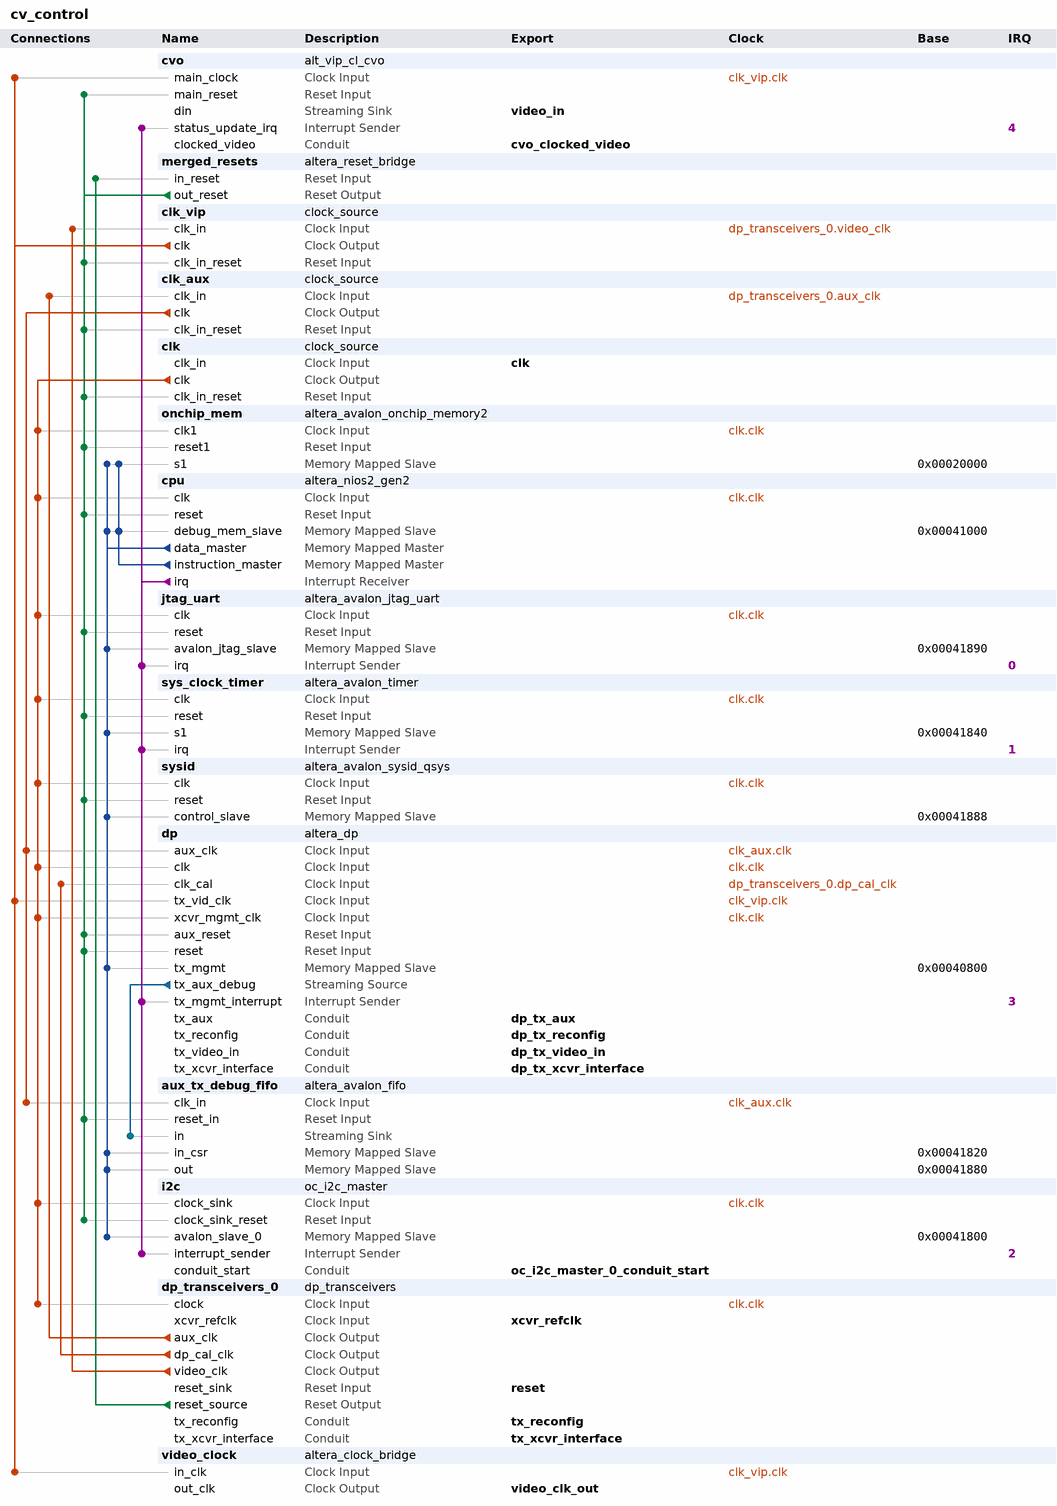
[diagram p0: system contents]
# Platform Designer (Qsys) system cv_control, Cyclone V 5CSXFC6C6U23C7
# Parameters at their usual value, and those the tool derives, are not listed.
package require -exact qsys 16.0
create_system cv_control
set_project_property DEVICE_FAMILY {Cyclone V}
set_project_property DEVICE 5CSXFC6C6U23C7

add_instance cvo alt_vip_cl_cvo 16.0
set_instance_parameter_value cvo ACCEPT_COLOURS_IN_SEQ 0
set_instance_parameter_value cvo ANC_LINE 0
set_instance_parameter_value cvo AP_LINE 0
set_instance_parameter_value cvo BPS 8
set_instance_parameter_value cvo CLOCKS_ARE_SAME 0
set_instance_parameter_value cvo COLOUR_PLANES_ARE_IN_PARALLEL 1
set_instance_parameter_value cvo CONTEXT_WIDTH 8
set_instance_parameter_value cvo DST_WIDTH 8
set_instance_parameter_value cvo FIELD0_ANC_LINE 0
set_instance_parameter_value cvo FIELD0_V_BACK_PORCH 0
set_instance_parameter_value cvo FIELD0_V_BLANK 0
set_instance_parameter_value cvo FIELD0_V_FRONT_PORCH 0
set_instance_parameter_value cvo FIELD0_V_RISING_EDGE 0
set_instance_parameter_value cvo FIELD0_V_SYNC_LENGTH 0
set_instance_parameter_value cvo FIFO_DEPTH 1920
set_instance_parameter_value cvo F_FALLING_EDGE 0
set_instance_parameter_value cvo F_RISING_EDGE 0
set_instance_parameter_value cvo GENERATE_SYNC 0
set_instance_parameter_value cvo H_ACTIVE_PIXELS 1920
set_instance_parameter_value cvo H_BACK_PORCH 80
set_instance_parameter_value cvo H_BLANK 0
set_instance_parameter_value cvo H_FRONT_PORCH 48
set_instance_parameter_value cvo H_SYNC_LENGTH 32
set_instance_parameter_value cvo INTERLACED 0
set_instance_parameter_value cvo NO_OF_CHANNELS 1
set_instance_parameter_value cvo NO_OF_MODES 1
set_instance_parameter_value cvo NUMBER_OF_COLOUR_PLANES 3
set_instance_parameter_value cvo PIXELS_IN_PARALLEL 1
set_instance_parameter_value cvo SRC_WIDTH 8
set_instance_parameter_value cvo STD_WIDTH 1
set_instance_parameter_value cvo TASK_WIDTH 8
set_instance_parameter_value cvo THRESHOLD 1919
set_instance_parameter_value cvo USE_CONTROL 0
set_instance_parameter_value cvo USE_EMBEDDED_SYNCS 0
set_instance_parameter_value cvo V_ACTIVE_LINES 1080
set_instance_parameter_value cvo V_BACK_PORCH 26
set_instance_parameter_value cvo V_BLANK 0
set_instance_parameter_value cvo V_FRONT_PORCH 3
set_instance_parameter_value cvo V_SYNC_LENGTH 6

add_instance merged_resets altera_reset_bridge 16.0
set_instance_parameter_value merged_resets ACTIVE_LOW_RESET 1
set_instance_parameter_value merged_resets SYNCHRONOUS_EDGES none

add_instance clk_vip clock_source 16.0
set_instance_parameter_value clk_vip clockFrequency 154000000

add_instance clk_aux clock_source 16.0
set_instance_parameter_value clk_aux clockFrequency 16000000

add_instance clk clock_source 16.0
set_instance_parameter_value clk clockFrequency 100000000

add_instance onchip_mem altera_avalon_onchip_memory2 16.0
set_instance_parameter_value onchip_mem dataWidth 32
set_instance_parameter_value onchip_mem dualPort false
set_instance_parameter_value onchip_mem initMemContent true
set_instance_parameter_value onchip_mem initializationFileName dp_demo.hex
set_instance_parameter_value onchip_mem memorySize 120000
set_instance_parameter_value onchip_mem useNonDefaultInitFile true

add_instance cpu altera_nios2_gen2 16.0
set_instance_parameter_value cpu dcache_size 2048
set_instance_parameter_value cpu exceptionSlave onchip_mem.s1
set_instance_parameter_value cpu icache_size 2048
set_instance_parameter_value cpu impl Tiny
set_instance_parameter_value cpu resetSlave onchip_mem.s1
set_instance_parameter_value cpu setting_activateTrace true

add_instance jtag_uart altera_avalon_jtag_uart 16.0
set_instance_parameter_value jtag_uart readBufferDepth 1024
set_instance_parameter_value jtag_uart readIRQThreshold 1
set_instance_parameter_value jtag_uart simInteractiveOptions INTERACTIVE_ASCII_OUTPUT
set_instance_parameter_value jtag_uart writeBufferDepth 1024
set_instance_parameter_value jtag_uart writeIRQThreshold 1

add_instance sys_clock_timer altera_avalon_timer 16.0
set_instance_parameter_value sys_clock_timer period 1
set_instance_parameter_value sys_clock_timer periodUnits MSEC

add_instance sysid altera_avalon_sysid_qsys 16.0
set_instance_parameter_value sysid id 0

add_instance dp altera_dp 16.0.1
set_instance_parameter_value dp RX_AUDIO_CHANS 2
set_instance_parameter_value dp RX_AUX_DEBUG 1
set_instance_parameter_value dp RX_AUX_GPU 0
set_instance_parameter_value dp RX_EXPORT_MSA 0
set_instance_parameter_value dp RX_I2C_SCL_KHZ 100
set_instance_parameter_value dp RX_IEEE_OUI 1
set_instance_parameter_value dp RX_MAX_LANE_COUNT 4
set_instance_parameter_value dp RX_MAX_LINK_RATE 10
set_instance_parameter_value dp RX_MAX_NUM_OF_STREAMS 1
set_instance_parameter_value dp RX_PIXELS_PER_CLOCK 1
set_instance_parameter_value dp RX_SCRAMBLER_SEED 65535
set_instance_parameter_value dp RX_SUPPORT_AUDIO 0
set_instance_parameter_value dp RX_SUPPORT_AUTOMATED_TEST 1
set_instance_parameter_value dp RX_SUPPORT_DP 0
set_instance_parameter_value dp RX_SUPPORT_GTC 0
set_instance_parameter_value dp RX_SUPPORT_I2CMASTER 0
set_instance_parameter_value dp RX_SUPPORT_MST 0
set_instance_parameter_value dp RX_SUPPORT_SS 0
set_instance_parameter_value dp RX_SYMBOLS_PER_CLOCK 2
set_instance_parameter_value dp RX_VIDEO_BPS 8
set_instance_parameter_value dp TX_AUDIO_CHANS 2
set_instance_parameter_value dp TX_AUX_DEBUG 1
set_instance_parameter_value dp TX_MAX_LANE_COUNT 4
set_instance_parameter_value dp TX_MAX_LINK_RATE 10
set_instance_parameter_value dp TX_MAX_NUM_OF_STREAMS 1
set_instance_parameter_value dp TX_PIXELS_PER_CLOCK 1
set_instance_parameter_value dp TX_SCRAMBLER_SEED 65535
set_instance_parameter_value dp TX_SUPPORT_ANALOG_RECONFIG 0
set_instance_parameter_value dp TX_SUPPORT_AUDIO 0
set_instance_parameter_value dp TX_SUPPORT_AUTOMATED_TEST 1
set_instance_parameter_value dp TX_SUPPORT_DP 1
set_instance_parameter_value dp TX_SUPPORT_GTC 0
set_instance_parameter_value dp TX_SUPPORT_MST 0
set_instance_parameter_value dp TX_SUPPORT_SS 0
set_instance_parameter_value dp TX_SYMBOLS_PER_CLOCK 2
set_instance_parameter_value dp TX_VIDEO_BPS 8
set_instance_parameter_value dp device_family {Cyclone V}

add_instance aux_tx_debug_fifo altera_avalon_fifo 16.0
set_instance_parameter_value aux_tx_debug_fifo bitsPerSymbol 32
set_instance_parameter_value aux_tx_debug_fifo channelWidth 1
set_instance_parameter_value aux_tx_debug_fifo errorWidth 1
set_instance_parameter_value aux_tx_debug_fifo fifoDepth 2048
set_instance_parameter_value aux_tx_debug_fifo fifoInputInterfaceOptions AVALONST_SINK
set_instance_parameter_value aux_tx_debug_fifo fifoOutputInterfaceOptions AVALONMM_READ
set_instance_parameter_value aux_tx_debug_fifo singleClockMode true
set_instance_parameter_value aux_tx_debug_fifo symbolsPerBeat 1
set_instance_parameter_value aux_tx_debug_fifo useBackpressure false
set_instance_parameter_value aux_tx_debug_fifo useIRQ false
set_instance_parameter_value aux_tx_debug_fifo usePacket true
set_instance_parameter_value aux_tx_debug_fifo useReadControl false

add_instance i2c oc_i2c_master 1.0

add_instance dp_transceivers_0 dp_transceivers 1.0
set_instance_parameter_value dp_transceivers_0 LANES 4
set_instance_parameter_value dp_transceivers_0 RX_SYMBOLS_PER_CLOCK 2
set_instance_parameter_value dp_transceivers_0 TX_POLINV 0
set_instance_parameter_value dp_transceivers_0 TX_SYMBOLS_PER_CLOCK 2

add_instance video_clock altera_clock_bridge 16.0
set_instance_parameter_value video_clock DERIVED_CLOCK_RATE 154000000
set_instance_parameter_value video_clock EXPLICIT_CLOCK_RATE 0

# connections
add_connection clk.clk cpu.clk clock
add_connection clk.clk dp.clk clock
add_connection clk.clk dp.xcvr_mgmt_clk clock
add_connection clk.clk dp_transceivers_0.clock clock
add_connection clk.clk i2c.clock_sink clock
add_connection clk.clk jtag_uart.clk clock
add_connection clk.clk onchip_mem.clk1 clock
add_connection clk.clk sys_clock_timer.clk clock
add_connection clk.clk sysid.clk clock
add_connection clk_aux.clk aux_tx_debug_fifo.clk_in clock
add_connection clk_aux.clk dp.aux_clk clock
add_connection clk_vip.clk cvo.main_clock clock
add_connection clk_vip.clk dp.tx_vid_clk clock
add_connection clk_vip.clk video_clock.in_clk clock
add_connection dp_transceivers_0.aux_clk clk_aux.clk_in clock
add_connection dp_transceivers_0.dp_cal_clk dp.clk_cal clock
add_connection dp_transceivers_0.video_clk clk_vip.clk_in clock
add_connection dp_transceivers_0.reset_source merged_resets.in_reset reset
add_connection merged_resets.out_reset aux_tx_debug_fifo.reset_in reset
add_connection merged_resets.out_reset clk.clk_in_reset reset
add_connection merged_resets.out_reset clk_aux.clk_in_reset reset
add_connection merged_resets.out_reset clk_vip.clk_in_reset reset
add_connection merged_resets.out_reset cpu.reset reset
add_connection merged_resets.out_reset cvo.main_reset reset
add_connection merged_resets.out_reset dp.aux_reset reset
add_connection merged_resets.out_reset dp.reset reset
add_connection merged_resets.out_reset i2c.clock_sink_reset reset
add_connection merged_resets.out_reset jtag_uart.reset reset
add_connection merged_resets.out_reset onchip_mem.reset1 reset
add_connection merged_resets.out_reset sys_clock_timer.reset reset
add_connection merged_resets.out_reset sysid.reset reset
add_connection cpu.data_master aux_tx_debug_fifo.in_csr avalon
set_connection_parameter_value cpu.data_master/aux_tx_debug_fifo.in_csr baseAddress 0x00041820
add_connection cpu.data_master aux_tx_debug_fifo.out avalon
set_connection_parameter_value cpu.data_master/aux_tx_debug_fifo.out baseAddress 0x00041880
add_connection cpu.data_master cpu.debug_mem_slave avalon
set_connection_parameter_value cpu.data_master/cpu.debug_mem_slave baseAddress 0x00041000
add_connection cpu.data_master dp.tx_mgmt avalon
set_connection_parameter_value cpu.data_master/dp.tx_mgmt baseAddress 0x00040800
add_connection cpu.data_master i2c.avalon_slave_0 avalon
set_connection_parameter_value cpu.data_master/i2c.avalon_slave_0 baseAddress 0x00041800
add_connection cpu.data_master jtag_uart.avalon_jtag_slave avalon
set_connection_parameter_value cpu.data_master/jtag_uart.avalon_jtag_slave baseAddress 0x00041890
add_connection cpu.data_master onchip_mem.s1 avalon
set_connection_parameter_value cpu.data_master/onchip_mem.s1 baseAddress 0x00020000
add_connection cpu.data_master sys_clock_timer.s1 avalon
set_connection_parameter_value cpu.data_master/sys_clock_timer.s1 baseAddress 0x00041840
add_connection cpu.data_master sysid.control_slave avalon
set_connection_parameter_value cpu.data_master/sysid.control_slave baseAddress 0x00041888
add_connection cpu.instruction_master cpu.debug_mem_slave avalon
set_connection_parameter_value cpu.instruction_master/cpu.debug_mem_slave baseAddress 0x00041000
add_connection cpu.instruction_master onchip_mem.s1 avalon
set_connection_parameter_value cpu.instruction_master/onchip_mem.s1 baseAddress 0x00020000
add_connection dp.tx_aux_debug aux_tx_debug_fifo.in avalon_streaming
add_connection cpu.irq cvo.status_update_irq interrupt
set_connection_parameter_value cpu.irq/cvo.status_update_irq irqNumber 4
add_connection cpu.irq dp.tx_mgmt_interrupt interrupt
set_connection_parameter_value cpu.irq/dp.tx_mgmt_interrupt irqNumber 3
add_connection cpu.irq i2c.interrupt_sender interrupt
set_connection_parameter_value cpu.irq/i2c.interrupt_sender irqNumber 2
add_connection cpu.irq jtag_uart.irq interrupt
set_connection_parameter_value cpu.irq/jtag_uart.irq irqNumber 0
add_connection cpu.irq sys_clock_timer.irq interrupt
set_connection_parameter_value cpu.irq/sys_clock_timer.irq irqNumber 1

# exported interfaces
add_interface clk clock sink
set_interface_property clk EXPORT_OF clk.clk_in
add_interface cvo_clocked_video conduit end
set_interface_property cvo_clocked_video EXPORT_OF cvo.clocked_video
add_interface dp_tx_aux conduit end
set_interface_property dp_tx_aux EXPORT_OF dp.tx_aux
add_interface dp_tx_reconfig conduit end
set_interface_property dp_tx_reconfig EXPORT_OF dp.tx_reconfig
add_interface dp_tx_video_in conduit end
set_interface_property dp_tx_video_in EXPORT_OF dp.tx_video_in
add_interface dp_tx_xcvr_interface conduit end
set_interface_property dp_tx_xcvr_interface EXPORT_OF dp.tx_xcvr_interface
add_interface oc_i2c_master_0_conduit_start conduit end
set_interface_property oc_i2c_master_0_conduit_start EXPORT_OF i2c.conduit_start
add_interface reset reset sink
set_interface_property reset EXPORT_OF dp_transceivers_0.reset_sink
add_interface tx_reconfig conduit end
set_interface_property tx_reconfig EXPORT_OF dp_transceivers_0.tx_reconfig
add_interface tx_xcvr_interface conduit end
set_interface_property tx_xcvr_interface EXPORT_OF dp_transceivers_0.tx_xcvr_interface
add_interface video_clk_out clock source
set_interface_property video_clk_out EXPORT_OF video_clock.out_clk
add_interface video_in avalon_streaming sink
set_interface_property video_in EXPORT_OF cvo.din
add_interface xcvr_refclk clock sink
set_interface_property xcvr_refclk EXPORT_OF dp_transceivers_0.xcvr_refclk

set_interconnect_requirement {$system} qsys_mm.clockCrossingAdapter HANDSHAKE
set_interconnect_requirement {$system} qsys_mm.maxAdditionalLatency 1

save_system cv_control.qsys
